# Altium schematic sheet RADG-GPSModule-S01-V00.SchDoc: RADG GPS Module (ZED-F9#, Powered Antenna)
size A3; DrawnBy: Jonn Dillon; DocumentNumber: 2; SheetNumber: 2; SheetTotal: 6; Version: 00; Project: QUTMS RADIO GPS; PageSetup: Record=PageOptions|CenterHorizontal=True|CenterVertical=True|PrintScale=0.97|XCorrection=1.00|YCorrection=1.00|PrintKind=0|BorderSize=5000000|LeftOffset=0|BottomOffset=0|Orientation=2|PaperLength=1000|PaperWidth=1000|Scale=100|PaperSource=7|PrintQuality=-4|MediaType=1|DitherType=10|PaperKind=A4|PrintScaleMode=1
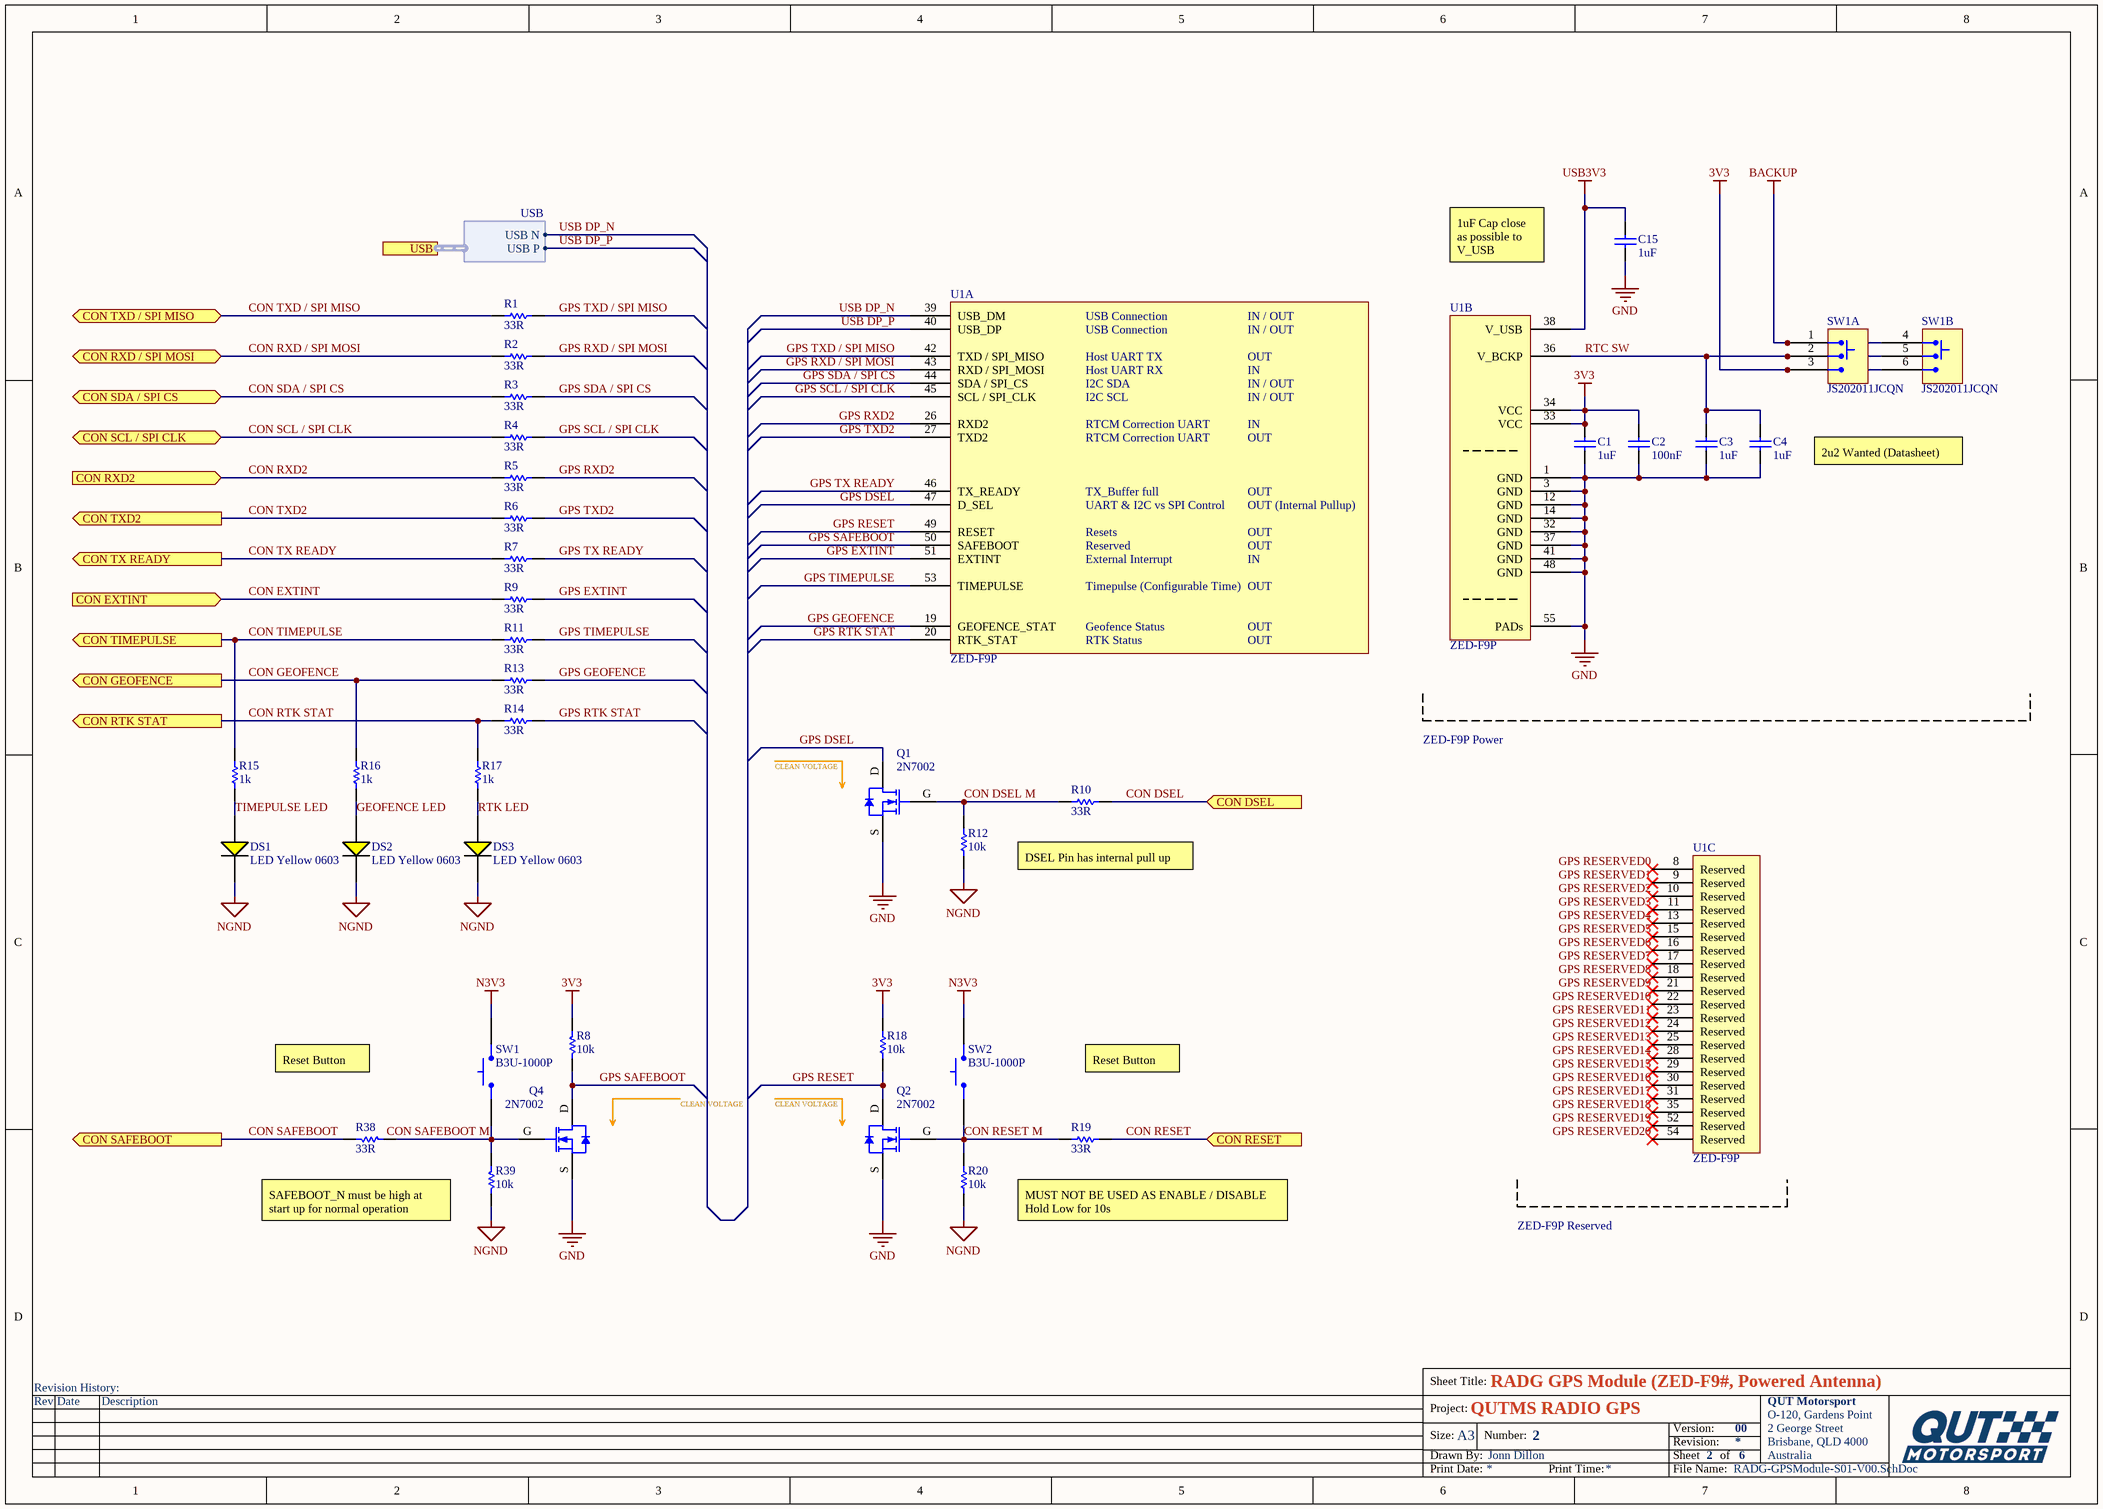
[diagram p0: RADG-GPSModule-S01-V00.SchDoc]

## Parts
(Parts that share a designator on the sheet are numbered #1, #2 ... from top to bottom, then left to right.)
C1  1uF  [Cap_Ceramic_0603]
C2  100nF  [Cap_Ceramic_0603]
C3  1uF  [Cap_Ceramic_0603]
C4  1uF  [Cap_Ceramic_0603]
C15  1uF  [Cap_Ceramic_0603]
DS1  LED Yellow 0603  [LED YELLOW 0603]
DS2  LED Yellow 0603  [LED YELLOW 0603]
DS3  LED Yellow 0603  [LED YELLOW 0603]
Q1  2N7002  [SOT23-3]
Q2  2N7002  [SOT23-3]
Q4  2N7002  [SOT23-3]
R1  33R  [Res_ThinFilm_0603]
R2  33R  [Res_ThinFilm_0603]
R3  33R  [Res_ThinFilm_0603]
R4  33R  [Res_ThinFilm_0603]
R5  33R  [Res_ThinFilm_0603]
R6  33R  [Res_ThinFilm_0603]
R7  33R  [Res_ThinFilm_0603]
R8  10k  [Res_ThinFilm_0603]
R9  33R  [Res_ThinFilm_0603]
R10  33R  [Res_ThinFilm_0603]
R11  33R  [Res_ThinFilm_0603]
R12  10k  [Res_ThinFilm_0603]
R13  33R  [Res_ThinFilm_0603]
R14  33R  [Res_ThinFilm_0603]
R15  1k  [Res_ThinFilm_0603]
R16  1k  [Res_ThinFilm_0603]
R17  1k  [Res_ThinFilm_0603]
R18  10k  [Res_ThinFilm_0603]
R19  33R  [Res_ThinFilm_0603]
R20  10k  [Res_ThinFilm_0603]
R38  33R  [Res_ThinFilm_0603]
R39  10k  [Res_ThinFilm_0603]
SW1#1  JS202011JCQN  [JS202011JCQN]  (parts A,B of 2)
SW1#2  B3U-1000P  [BTN B3U-1000P]
SW2  B3U-1000P  [BTN B3U-1000P]
U1  ZED-F9P  [uBlox_ZED-F9P]  (parts A,B,C of 4)

## Ports
CON DSEL (in), CON EXTINT (in), CON GEOFENCE (out), CON RESET (in), CON RTK STAT (out), CON RXD2 (in), CON RXD / SPI MOSI (bidir), CON SAFEBOOT (out), CON SCL / SPI CLK (bidir), CON SDA / SPI CS (bidir), CON TIMEPULSE (out), CON TX READY (out), CON TXD2 (out), CON TXD / SPI MISO (bidir), USB (harness USB)

## Harnesses
USB: USB P, USB N

## Nets
3V3: C1.2 C2.2 R8.2 R18.2 SW1#1.3 SW1#1.6 U1.33(VCC) U1.34(VCC)
BACKUP: SW1#1.1 SW1#1.4
GND: C1.1 C2.1 C3.1 C4.1 C15.1 Q1.S Q2.S Q4.S U1.1(GND) U1.3(GND) U1.12(GND) U1.14(GND) U1.32(GND) U1.37(GND) U1.41(GND) U1.48(GND) U1.55(PADs)
N3V3: SW1#2.2 SW2.2
NGND: DS1.2(C) DS2.2(C) DS3.2(C) R12.1 R20.1 R39.1
USB3V3: C15.2 U1.38(V_USB)
CON DSEL: R10.2 ; port CON DSEL
CON DSEL M: Q1.G R10.1 R12.2
CON EXTINT: R9.1 ; port CON EXTINT
CON GEOFENCE: R13.1 R16.2 ; port CON GEOFENCE
CON RESET: R19.2 ; port CON RESET
CON RESET M: Q2.G R19.1 R20.2 SW2.1
CON RTK STAT: R14.1 R17.2 ; port CON RTK STAT
CON RXD2: R5.1 ; port CON RXD2
CON RXD / SPI MOSI: R2.1 ; port CON RXD / SPI MOSI
CON SAFEBOOT: R38.2 ; port CON SAFEBOOT
CON SAFEBOOT M: Q4.G R38.1 R39.2 SW1#2.1
CON SCL / SPI CLK: R4.1 ; port CON SCL / SPI CLK
CON SDA / SPI CS: R3.1 ; port CON SDA / SPI CS
CON TIMEPULSE: R11.1 R15.2 ; port CON TIMEPULSE
CON TX READY: R7.1 ; port CON TX READY
CON TXD2: R6.1 ; port CON TXD2
CON TXD / SPI MISO: R1.1 ; port CON TXD / SPI MISO
GEOFENCE LED: DS2.1(A) R16.1
GPS DSEL: Q1.D U1.47(D_SEL)
GPS EXTINT: R9.2 U1.51(EXTINT)
GPS GEOFENCE: R13.2 U1.19(GEOFENCE_STAT)
GPS RESERVED0: U1.8(Reserved)
GPS RESERVED1: U1.9(Reserved)
GPS RESERVED2: U1.10(Reserved)
GPS RESERVED3: U1.11(Reserved)
GPS RESERVED4: U1.13(Reserved)
GPS RESERVED5: U1.15(Reserved)
GPS RESERVED6: U1.16(Reserved)
GPS RESERVED7: U1.17(Reserved)
GPS RESERVED8: U1.18(Reserved)
GPS RESERVED9: U1.21(Reserved)
GPS RESERVED10: U1.22(Reserved)
GPS RESERVED11: U1.23(Reserved)
GPS RESERVED12: U1.24(Reserved)
GPS RESERVED13: U1.25(Reserved)
GPS RESERVED14: U1.28(Reserved)
GPS RESERVED15: U1.29(Reserved)
GPS RESERVED16: U1.30(Reserved)
GPS RESERVED17: U1.31(Reserved)
GPS RESERVED18: U1.35(Reserved)
GPS RESERVED19: U1.52(Reserved)
GPS RESERVED20: U1.54(Reserved)
GPS RESET: Q2.D R18.1 U1.49(RESET)
GPS RTK STAT: R14.2 U1.20(RTK_STAT)
GPS RXD2: R5.2 U1.26(RXD2)
GPS RXD / SPI MOSI: R2.2 U1.43(RXD_/_SPI_MOSI)
GPS SAFEBOOT: Q4.D R8.1 U1.50(SAFEBOOT)
GPS SCL / SPI CLK: R4.2 U1.45(SCL_/_SPI_CLK)
GPS SDA / SPI CS: R3.2 U1.44(SDA_/_SPI_CS)
GPS TIMEPULSE: R11.2 U1.53(TIMEPULSE)
GPS TX READY: R7.2 U1.46(TX_READY)
GPS TXD2: R6.2 U1.27(TXD2)
GPS TXD / SPI MISO: R1.2 U1.42(TXD_/_SPI_MISO)
RTC SW: C3.2 C4.2 SW1#1.2 SW1#1.5 U1.36(V_BCKP)
RTK LED: DS3.1(A) R17.1
TIMEPULSE LED: DS1.1(A) R15.1
USB DP_N: U1.39(USB_DM) ; port USB.USB N
USB DP_P: U1.40(USB_DP) ; port USB.USB P

## Notes on the sheet
- 1uF Cap close as possible to V_USB
- 2u2 Wanted (Datasheet)
- CLEAN VOLTAGE
- ZED-F9P Power
- DSEL Pin has internal pull up
- Reset Button
- SAFEBOOT_N must be high at start up for normal operation
- MUST NOT BE USED AS ENABLE / DISABLE
  Hold Low for 10s
- ZED-F9P Reserved
- Revision History:
- Sheet Title:
- Rev
- Date
- Description
- Project:
- Size:
- Drawn By:
- A3
- Number:
- Revision:
- Sheet
- Version:
- of
- QUT Motorsport
- O-120, Gardens Point
- 2 George Street
- Brisbane, QLD 4000
- Australia
- Print Date:
- Print Time:
- File Name:
- (in symbol ZED-F9P, part A) USB Connection; IN / OUT; Host UART TX; OUT; Host UART RX; IN; I2C SDA; I2C SCL; RTCM Correction UART; TX_Buffer full; UART & I2C vs SPI Control; OUT (Internal Pullup); Resets; External Interrupt; Timepulse (Configurable Time); Geofence Status; RTK Status

## Library data of the parts
C1 C3 C4 C15 = 1uF 25V 5% X7R 0603: Capacitor, Ceramic, SMD, 1uF, 25V, 5%, X7R, 0603
C2 = 100nF 50V 5% X7R 0603: Capacitor, Ceramic, SMD, 100nF, 50V, 5%, X7R, 0603
R1-R7 R9-R11 R13 R14 R19 R38 = 33R 5% 0603: Resistor, SMD, 33R, 0.1W, 5%, 0603
R8 R12 R18 R20 R39 = 10k 5% 0603: Resistor, SMD, 10k, 0.1W, 5%, 0603
R15-R17 = 1k 5% 0603: Resistor, SMD, 1k, 0.1W, 5%, 0603
SW1#1 = SLIDE DPDT JS202011JCQN
SW1#2 SW2 = BTN B3U-1000P: Omron B3U-1000P Ultra Miniture Switch; ComponentLink1Description: LCSC; ComponentLink1URL: https://lcsc.com/product-detail/Tactile-Switches_BRIGHT-TSA063G50-250_C294565.html